# Altium schematic sheet COVER PAGE.SchDoc
size A; SheetNumber: 1; SheetTotal: 9
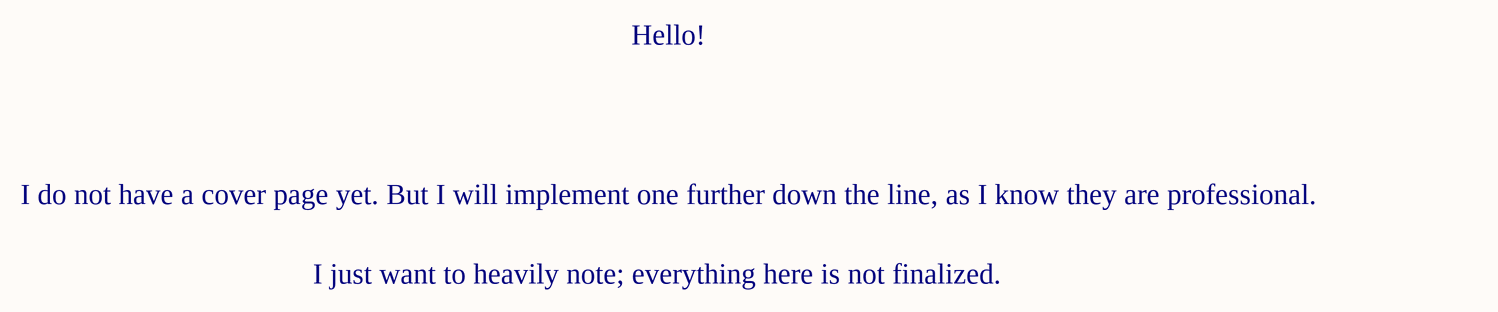
[diagram p0: COVER PAGE.SchDoc]

## Notes on the sheet
- Hello!
- I do not have a cover page yet. But I will implement one further down the line, as I know they are professional.
- I just want to heavily note; everything here is not finalized.